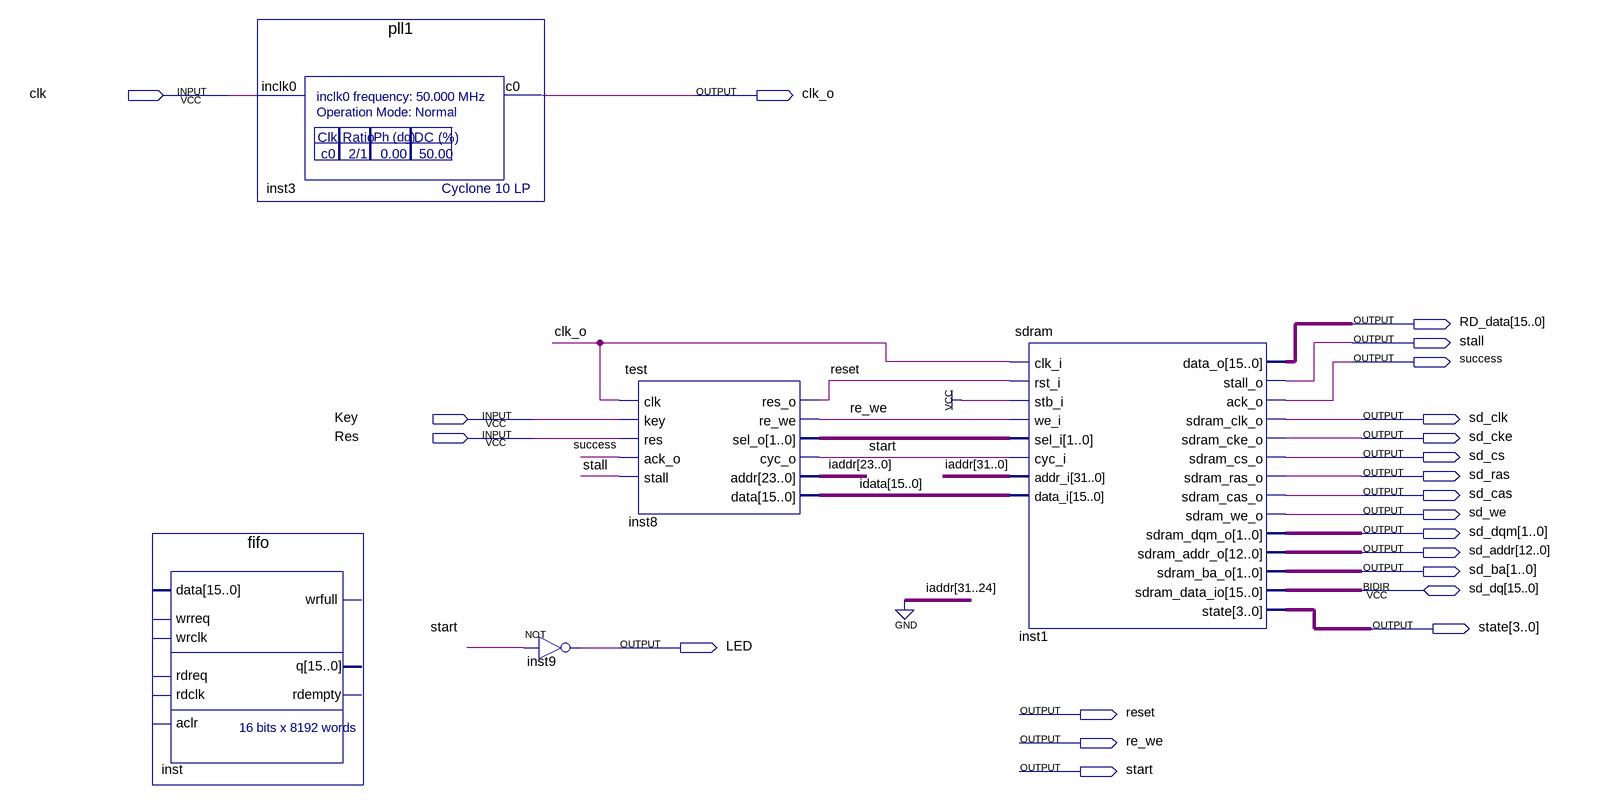
[diagram p0: schematic sheet]
// Quartus schematic burst_.bdf as structural Verilog: 5 symbols, 22 pins
module burst_ (
  input  clk,
  input  Key,
  input  Res,
  inout  [15:0] sd_dq,
  output clk_o,
  output [15:0] RD_data,
  output stall,
  output success,
  output sd_clk,
  output sd_cke,
  output sd_cs,
  output sd_ras,
  output sd_cas,
  output sd_we,
  output [1:0] sd_dqm,
  output [12:0] sd_addr,
  output [1:0] sd_ba,
  output [3:0] state,
  output LED,
  output reset,
  output re_we,
  output start
);

  wire [1:0] inst8_sel_o;
  wire [15:0] idata;
  wire [23:0] iaddr;

  fifo inst ();  // open: data, wrreq, wrclk, rdreq, rdclk, aclr, wrfull, q, rdempty
  pll1 inst3 (.inclk0(clk), .c0(clk_o));
  not inst9 (LED, start);
  test inst8 (
    .clk(clk_o), .key(Key), .res(Res), .ack_o(success), .stall(stall), .res_o(reset), .re_we(re_we),
    .sel_o(inst8_sel_o), .cyc_o(start), .addr(iaddr), .data(idata));
  sdram inst1 (
    .clk_i(clk_o), .rst_i(reset), .stb_i(1'b1), .we_i(re_we), .sel_i(inst8_sel_o), .cyc_i(start),
    .addr_i({{8{1'b0}}, iaddr}), .data_i(idata), .data_o(RD_data), .stall_o(stall), .ack_o(success),
    .sdram_clk_o(sd_clk), .sdram_cke_o(sd_cke), .sdram_cs_o(sd_cs), .sdram_ras_o(sd_ras),
    .sdram_cas_o(sd_cas), .sdram_we_o(sd_we), .sdram_dqm_o(sd_dqm), .sdram_addr_o(sd_addr),
    .sdram_ba_o(sd_ba), .state(state), .sdram_data_io(sd_dq));
endmodule
